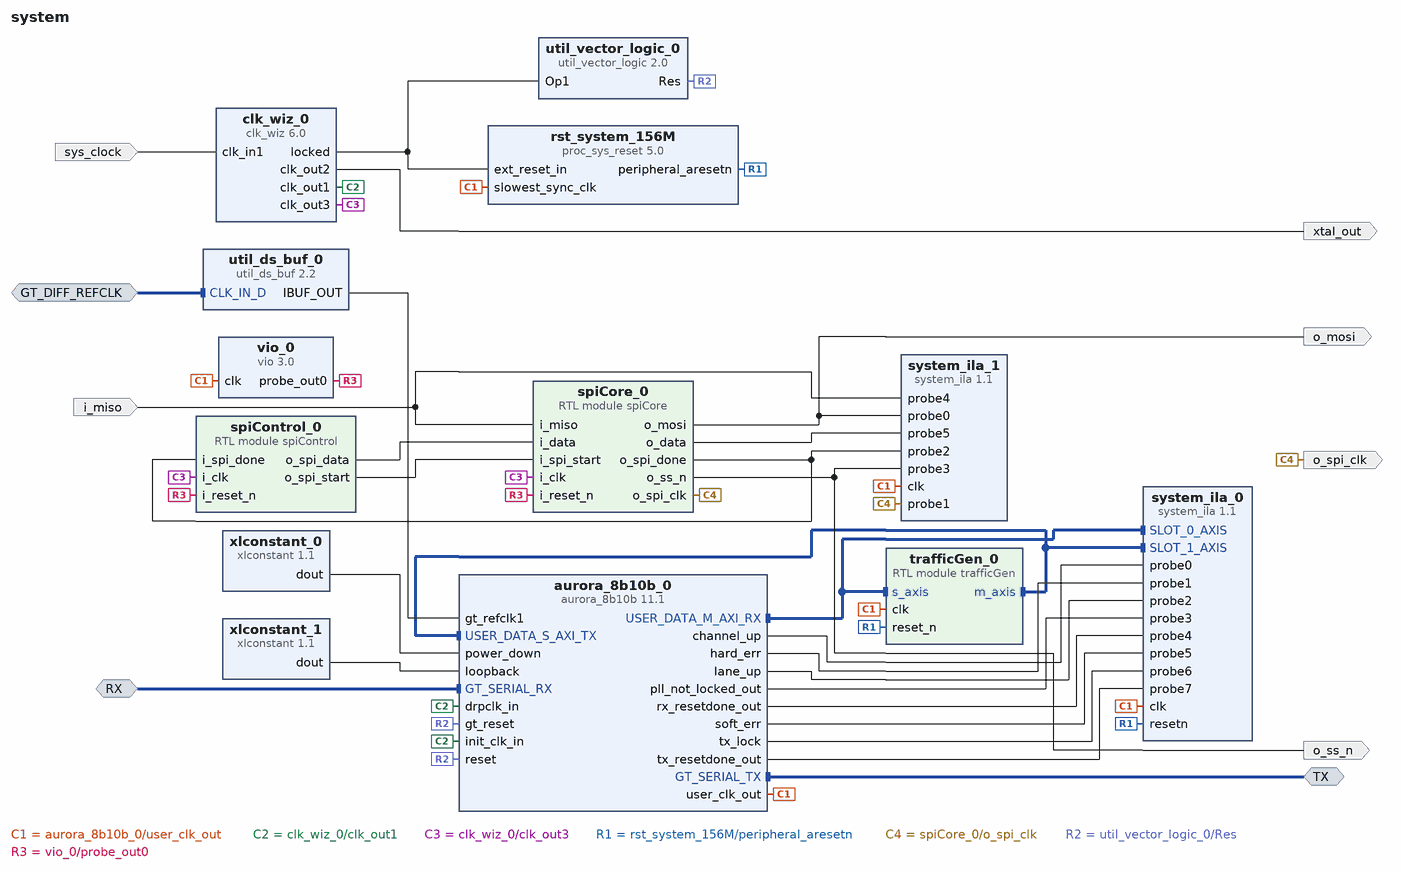
[diagram p0: block diagram of the top level]
# Vivado block design system, xc7a50tcsg325-2, Vivado 2022.2
create_bd_design system

create_bd_intf_port -mode Master -vlnv xilinx.com:display_aurora:GT_Serial_Transceiver_Pins_TX_rtl:1.0 TX
create_bd_intf_port -mode Slave -vlnv xilinx.com:display_aurora:GT_Serial_Transceiver_Pins_RX_rtl:1.0 RX
create_bd_intf_port -mode Slave -vlnv xilinx.com:interface:diff_clock_rtl:1.0 GT_DIFF_REFCLK
set_property -dict {CONFIG.FREQ_HZ 125000000} [get_bd_intf_ports GT_DIFF_REFCLK]
create_bd_port -dir I -type clk sys_clock
set_property -dict {CONFIG.FREQ_HZ 25000000 CONFIG.PHASE 0.0} [get_bd_ports sys_clock]
create_bd_port -dir I i_miso
create_bd_port -dir O o_mosi
create_bd_port -dir O o_ss_n
create_bd_port -dir O -type clk o_spi_clk
create_bd_port -dir O -type clk xtal_out

create_bd_cell -type ip -vlnv xilinx.com:ip:aurora_8b10b:11.1 aurora_8b10b_0
set_property -dict [list \
  CONFIG.C_DRP_IF false \
  CONFIG.C_LINE_RATE 3.125 \
  CONFIG.Interface_Mode Streaming \
  CONFIG.SINGLEEND_GTREFCLK true \
  CONFIG.SINGLEEND_INITCLK true \
  CONFIG.SupportLevel 1 \
] [get_bd_cells aurora_8b10b_0]
create_bd_cell -type ip -vlnv xilinx.com:ip:xlconstant:1.1 xlconstant_0
set_property -dict {CONFIG.CONST_VAL 0} [get_bd_cells xlconstant_0]
create_bd_cell -type ip -vlnv xilinx.com:ip:xlconstant:1.1 xlconstant_1
set_property -dict {CONFIG.CONST_VAL 2 CONFIG.CONST_WIDTH 3} [get_bd_cells xlconstant_1]
create_bd_cell -type ip -vlnv xilinx.com:ip:util_vector_logic:2.0 util_vector_logic_0
set_property -dict {CONFIG.C_OPERATION not} [get_bd_cells util_vector_logic_0]
create_bd_cell -type ip -vlnv xilinx.com:ip:util_ds_buf:2.2 util_ds_buf_0
set_property -dict {CONFIG.DIFF_CLK_IN_BOARD_INTERFACE mgt_diff_clock1 CONFIG.USE_BOARD_FLOW true} [get_bd_cells util_ds_buf_0]
create_bd_cell -type ip -vlnv xilinx.com:ip:clk_wiz:6.0 clk_wiz_0
set_property -dict [list \
  CONFIG.CLKOUT1_JITTER 311.098 \
  CONFIG.CLKOUT1_PHASE_ERROR 249.865 \
  CONFIG.CLKOUT1_REQUESTED_OUT_FREQ 50.000 \
  CONFIG.CLKOUT2_JITTER 471.719 \
  CONFIG.CLKOUT2_PHASE_ERROR 249.865 \
  CONFIG.CLKOUT2_REQUESTED_OUT_FREQ 12 \
  CONFIG.CLKOUT2_USED true \
  CONFIG.CLKOUT3_JITTER 522.153 \
  CONFIG.CLKOUT3_PHASE_ERROR 249.865 \
  CONFIG.CLKOUT3_REQUESTED_OUT_FREQ 6 \
  CONFIG.CLKOUT3_USED true \
  CONFIG.CLK_IN1_BOARD_INTERFACE sys_clock \
  CONFIG.MMCM_CLKFBOUT_MULT_F 36.000 \
  CONFIG.MMCM_CLKOUT0_DIVIDE_F 18.000 \
  CONFIG.MMCM_CLKOUT1_DIVIDE 75 \
  CONFIG.MMCM_CLKOUT2_DIVIDE 128 \
  CONFIG.NUM_OUT_CLKS 3 \
  CONFIG.USE_BOARD_FLOW true \
  CONFIG.USE_RESET false \
] [get_bd_cells clk_wiz_0]
create_bd_cell -type ip -vlnv xilinx.com:ip:system_ila:1.1 system_ila_0
set_property -dict [list \
  CONFIG.C_MON_TYPE MIX \
  CONFIG.C_NUM_MONITOR_SLOTS 2 \
  CONFIG.C_NUM_OF_PROBES 8 \
  CONFIG.C_PROBE0_TYPE 0 \
  CONFIG.C_PROBE1_TYPE 0 \
  CONFIG.C_PROBE2_TYPE 0 \
  CONFIG.C_PROBE3_TYPE 0 \
  CONFIG.C_PROBE4_TYPE 0 \
  CONFIG.C_PROBE5_TYPE 0 \
  CONFIG.C_PROBE6_TYPE 0 \
  CONFIG.C_PROBE7_TYPE 0 \
  CONFIG.C_SLOT 0 \
  CONFIG.C_SLOT_0_APC_EN 0 \
  CONFIG.C_SLOT_0_AXI_DATA_SEL 1 \
  CONFIG.C_SLOT_0_AXI_TRIG_SEL 1 \
  CONFIG.C_SLOT_0_INTF_TYPE xilinx.com:interface:axis_rtl:1.0 \
  CONFIG.C_SLOT_1_APC_EN 0 \
  CONFIG.C_SLOT_1_AXI_DATA_SEL 1 \
  CONFIG.C_SLOT_1_AXI_TRIG_SEL 1 \
  CONFIG.C_SLOT_1_INTF_TYPE xilinx.com:interface:axis_rtl:1.0 \
  CONFIG.C_SLOT_2_INTF_TYPE xilinx.com:interface:axis_rtl:1.0 \
  CONFIG.C_SLOT_3_INTF_TYPE xilinx.com:interface:axis_rtl:1.0 \
] [get_bd_cells system_ila_0]
create_bd_cell -type ip -vlnv xilinx.com:ip:proc_sys_reset:5.0 rst_system_156M
create_bd_cell -type module -reference spiCore spiCore_0
create_bd_cell -type ip -vlnv xilinx.com:ip:system_ila:1.1 system_ila_1
set_property -dict [list \
  CONFIG.C_DATA_DEPTH 65536 \
  CONFIG.C_MON_TYPE NATIVE \
  CONFIG.C_NUM_OF_PROBES 6 \
  CONFIG.C_PROBE0_TYPE 0 \
  CONFIG.C_PROBE1_TYPE 0 \
  CONFIG.C_PROBE2_TYPE 0 \
  CONFIG.C_PROBE3_TYPE 0 \
  CONFIG.C_PROBE4_TYPE 0 \
] [get_bd_cells system_ila_1]
create_bd_cell -type module -reference trafficGen trafficGen_0
create_bd_cell -type module -reference spiControl spiControl_0
create_bd_cell -type ip -vlnv xilinx.com:ip:vio:3.0 vio_0
set_property -dict {CONFIG.C_NUM_PROBE_IN 0} [get_bd_cells vio_0]

# ---- connections ----

connect_bd_intf_net -intf_net GT_SERIAL_RX_0_1 [get_bd_intf_ports RX] [get_bd_intf_pins aurora_8b10b_0/GT_SERIAL_RX]
connect_bd_intf_net [get_bd_intf_ports TX] [get_bd_intf_pins aurora_8b10b_0/GT_SERIAL_TX]
connect_bd_intf_net -intf_net aurora_8b10b_0_USER_DATA_M_AXI_RX [get_bd_intf_pins aurora_8b10b_0/USER_DATA_M_AXI_RX] [get_bd_intf_pins trafficGen_0/s_axis]
connect_bd_intf_net [get_bd_intf_pins aurora_8b10b_0/USER_DATA_M_AXI_RX] [get_bd_intf_pins system_ila_0/SLOT_0_AXIS]
connect_bd_intf_net -intf_net mgt_diff_clock1_1 [get_bd_intf_ports GT_DIFF_REFCLK] [get_bd_intf_pins util_ds_buf_0/CLK_IN_D]
connect_bd_intf_net -intf_net trafficGen_0_m_axis [get_bd_intf_pins trafficGen_0/m_axis] [get_bd_intf_pins aurora_8b10b_0/USER_DATA_S_AXI_TX]
connect_bd_intf_net [get_bd_intf_pins trafficGen_0/m_axis] [get_bd_intf_pins system_ila_0/SLOT_1_AXIS]
connect_bd_net [get_bd_pins aurora_8b10b_0/user_clk_out] \
  [get_bd_pins system_ila_0/clk] [get_bd_pins rst_system_156M/slowest_sync_clk] [get_bd_pins system_ila_1/clk] \
  [get_bd_pins trafficGen_0/clk] [get_bd_pins vio_0/clk]
connect_bd_net -net channel_up [get_bd_pins aurora_8b10b_0/channel_up] [get_bd_pins system_ila_0/probe0]
connect_bd_net [get_bd_pins clk_wiz_0/clk_out1] [get_bd_pins aurora_8b10b_0/drpclk_in] [get_bd_pins aurora_8b10b_0/init_clk_in]
connect_bd_net [get_bd_pins clk_wiz_0/clk_out2] [get_bd_ports xtal_out]
connect_bd_net [get_bd_pins clk_wiz_0/clk_out3] [get_bd_pins spiCore_0/i_clk] [get_bd_pins spiControl_0/i_clk]
connect_bd_net [get_bd_pins clk_wiz_0/locked] [get_bd_pins util_vector_logic_0/Op1] [get_bd_pins rst_system_156M/ext_reset_in]
connect_bd_net -net hard_err [get_bd_pins aurora_8b10b_0/hard_err] [get_bd_pins system_ila_0/probe1]
connect_bd_net -net i_miso_0_1 [get_bd_ports i_miso] [get_bd_pins spiCore_0/i_miso] [get_bd_pins system_ila_1/probe4]
connect_bd_net -net lane_up [get_bd_pins aurora_8b10b_0/lane_up] [get_bd_pins system_ila_0/probe2]
connect_bd_net -net pll_not_locked_out [get_bd_pins aurora_8b10b_0/pll_not_locked_out] [get_bd_pins system_ila_0/probe3]
connect_bd_net [get_bd_pins rst_system_156M/peripheral_aresetn] [get_bd_pins system_ila_0/resetn] [get_bd_pins trafficGen_0/reset_n]
connect_bd_net -net rx_resetdone_out [get_bd_pins aurora_8b10b_0/rx_resetdone_out] [get_bd_pins system_ila_0/probe4]
connect_bd_net -net soft_err [get_bd_pins aurora_8b10b_0/soft_err] [get_bd_pins system_ila_0/probe5]
connect_bd_net [get_bd_pins spiControl_0/o_spi_data] [get_bd_pins spiCore_0/i_data]
connect_bd_net [get_bd_pins spiCore_0/o_data] [get_bd_pins system_ila_1/probe5]
connect_bd_net -net spiCore_0_o_mosi [get_bd_pins spiCore_0/o_mosi] [get_bd_ports o_mosi] [get_bd_pins system_ila_1/probe0]
connect_bd_net -net spiCore_0_o_spi_clk [get_bd_pins spiCore_0/o_spi_clk] [get_bd_ports o_spi_clk] [get_bd_pins system_ila_1/probe1]
connect_bd_net -net spiCore_0_o_spi_done [get_bd_pins spiCore_0/o_spi_done] [get_bd_pins system_ila_1/probe2] [get_bd_pins spiControl_0/i_spi_done]
connect_bd_net -net spiCore_0_o_ss_n [get_bd_pins spiCore_0/o_ss_n] [get_bd_ports o_ss_n] [get_bd_pins system_ila_1/probe3]
connect_bd_net [get_bd_ports sys_clock] [get_bd_pins clk_wiz_0/clk_in1]
connect_bd_net -net tx_lock [get_bd_pins aurora_8b10b_0/tx_lock] [get_bd_pins system_ila_0/probe6]
connect_bd_net -net tx_resetdone_out [get_bd_pins aurora_8b10b_0/tx_resetdone_out] [get_bd_pins system_ila_0/probe7]
connect_bd_net [get_bd_pins util_ds_buf_0/IBUF_OUT] [get_bd_pins aurora_8b10b_0/gt_refclk1]
connect_bd_net [get_bd_pins util_vector_logic_0/Res] [get_bd_pins aurora_8b10b_0/reset] [get_bd_pins aurora_8b10b_0/gt_reset]
connect_bd_net -net util_vector_logic_1_Res [get_bd_pins spiControl_0/o_spi_start] [get_bd_pins spiCore_0/i_spi_start]
connect_bd_net [get_bd_pins vio_0/probe_out0] [get_bd_pins spiCore_0/i_reset_n] [get_bd_pins spiControl_0/i_reset_n]
connect_bd_net [get_bd_pins xlconstant_0/dout] [get_bd_pins aurora_8b10b_0/power_down]
connect_bd_net [get_bd_pins xlconstant_1/dout] [get_bd_pins aurora_8b10b_0/loopback]
set_property HDL_ATTRIBUTE.DEBUG true [get_bd_intf_nets aurora_8b10b_0_USER_DATA_M_AXI_RX]
set_property HDL_ATTRIBUTE.MARK_DEBUG true [get_bd_intf_nets aurora_8b10b_0_USER_DATA_M_AXI_RX]
set_property HDL_ATTRIBUTE.DEBUG true [get_bd_intf_nets trafficGen_0_m_axis]
set_property HDL_ATTRIBUTE.MARK_DEBUG true [get_bd_intf_nets trafficGen_0_m_axis]
set_property HDL_ATTRIBUTE.DEBUG true [get_bd_nets channel_up]
set_property HDL_ATTRIBUTE.MARK_DEBUG true [get_bd_nets channel_up]
set_property HDL_ATTRIBUTE.DEBUG true [get_bd_nets hard_err]
set_property HDL_ATTRIBUTE.MARK_DEBUG true [get_bd_nets hard_err]
set_property HDL_ATTRIBUTE.DEBUG true [get_bd_nets lane_up]
set_property HDL_ATTRIBUTE.MARK_DEBUG true [get_bd_nets lane_up]
set_property HDL_ATTRIBUTE.DEBUG true [get_bd_nets pll_not_locked_out]
set_property HDL_ATTRIBUTE.MARK_DEBUG true [get_bd_nets pll_not_locked_out]
set_property HDL_ATTRIBUTE.DEBUG true [get_bd_nets rx_resetdone_out]
set_property HDL_ATTRIBUTE.MARK_DEBUG true [get_bd_nets rx_resetdone_out]
set_property HDL_ATTRIBUTE.DEBUG true [get_bd_nets soft_err]
set_property HDL_ATTRIBUTE.MARK_DEBUG true [get_bd_nets soft_err]
set_property HDL_ATTRIBUTE.DEBUG true [get_bd_nets spiCore_0_o_mosi]
set_property HDL_ATTRIBUTE.MARK_DEBUG true [get_bd_nets spiCore_0_o_mosi]
set_property HDL_ATTRIBUTE.DEBUG true [get_bd_nets spiCore_0_o_spi_clk]
set_property HDL_ATTRIBUTE.MARK_DEBUG true [get_bd_nets spiCore_0_o_spi_clk]
set_property HDL_ATTRIBUTE.DEBUG true [get_bd_nets spiCore_0_o_spi_done]
set_property HDL_ATTRIBUTE.MARK_DEBUG true [get_bd_nets spiCore_0_o_spi_done]
set_property HDL_ATTRIBUTE.DEBUG true [get_bd_nets spiCore_0_o_ss_n]
set_property HDL_ATTRIBUTE.MARK_DEBUG true [get_bd_nets spiCore_0_o_ss_n]
set_property HDL_ATTRIBUTE.DEBUG true [get_bd_nets tx_lock]
set_property HDL_ATTRIBUTE.MARK_DEBUG true [get_bd_nets tx_lock]
set_property HDL_ATTRIBUTE.DEBUG true [get_bd_nets tx_resetdone_out]
set_property HDL_ATTRIBUTE.MARK_DEBUG true [get_bd_nets tx_resetdone_out]

validate_bd_design
save_bd_design
